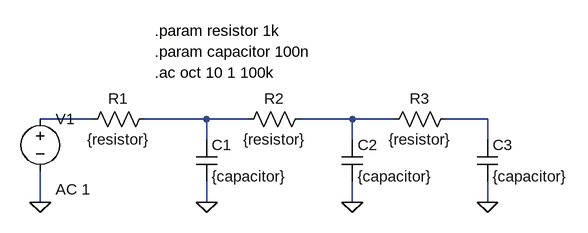
[diagram p0: schematic EP3_lpf.asc]
EP3_lpf.asc, the LTspice schematic file:
Version 4.1
SHEET 1 880 680
WIRE 16 96 -64 96
WIRE 192 96 96 96
WIRE 256 96 192 96
WIRE 416 96 336 96
WIRE 480 96 416 96
WIRE 624 96 560 96
WIRE 192 128 192 96
WIRE 416 128 416 96
WIRE 624 128 624 96
WIRE -64 224 -64 176
WIRE 192 224 192 192
WIRE 416 224 416 192
WIRE 624 224 624 192
FLAG -64 224 0
FLAG 192 224 0
FLAG 416 224 0
FLAG 624 224 0
SYMBOL voltage -64 80 R0
WINDOW 123 24 124 Left 2
WINDOW 39 0 0 Left 0
SYMATTR InstName V1
SYMATTR Value ""
SYMATTR Value2 AC 1
SYMBOL res 112 80 R90
WINDOW 0 0 56 VBottom 2
WINDOW 3 32 56 VTop 2
SYMATTR InstName R1
SYMATTR Value {resistor}
SYMBOL res 352 80 R90
WINDOW 0 0 56 VBottom 2
WINDOW 3 32 56 VTop 2
SYMATTR InstName R2
SYMATTR Value {resistor}
SYMBOL res 576 80 R90
WINDOW 0 0 56 VBottom 2
WINDOW 3 32 56 VTop 2
SYMATTR InstName R3
SYMATTR Value {resistor}
SYMBOL cap 176 128 R0
SYMATTR InstName C1
SYMATTR Value {capacitor}
SYMBOL cap 400 128 R0
SYMATTR InstName C2
SYMATTR Value {capacitor}
SYMBOL cap 608 128 R0
SYMATTR InstName C3
SYMATTR Value {capacitor}
TEXT 112 -40 Left 2 !.param resistor 1k
TEXT 112 -8 Left 2 !.param capacitor 100n
TEXT 112 24 Left 2 !.ac oct 10 1 100k

The netlist it stands for:
* EP3_lpf.asc
V1 N001 0 AC 1
R1 N002 N001 {resistor}
R2 N003 N002 {resistor}
R3 N004 N003 {resistor}
C1 N002 0 {capacitor}
C2 N003 0 {capacitor}
C3 N004 0 {capacitor}
.param resistor 1k
.param capacitor 100n
.ac oct 10 1 100k
.backanno
.end